# EasyEDA Pro project 完整工程.epro

# Schematic Schematic1
Create Date: 2024-04-10; Page Name: P1; Project Name: renases; Schematic Name: Schematic1; Update Date: 2024-05-06; Company: 嘉立创EDA; Page Size: A4; Version: V1.0
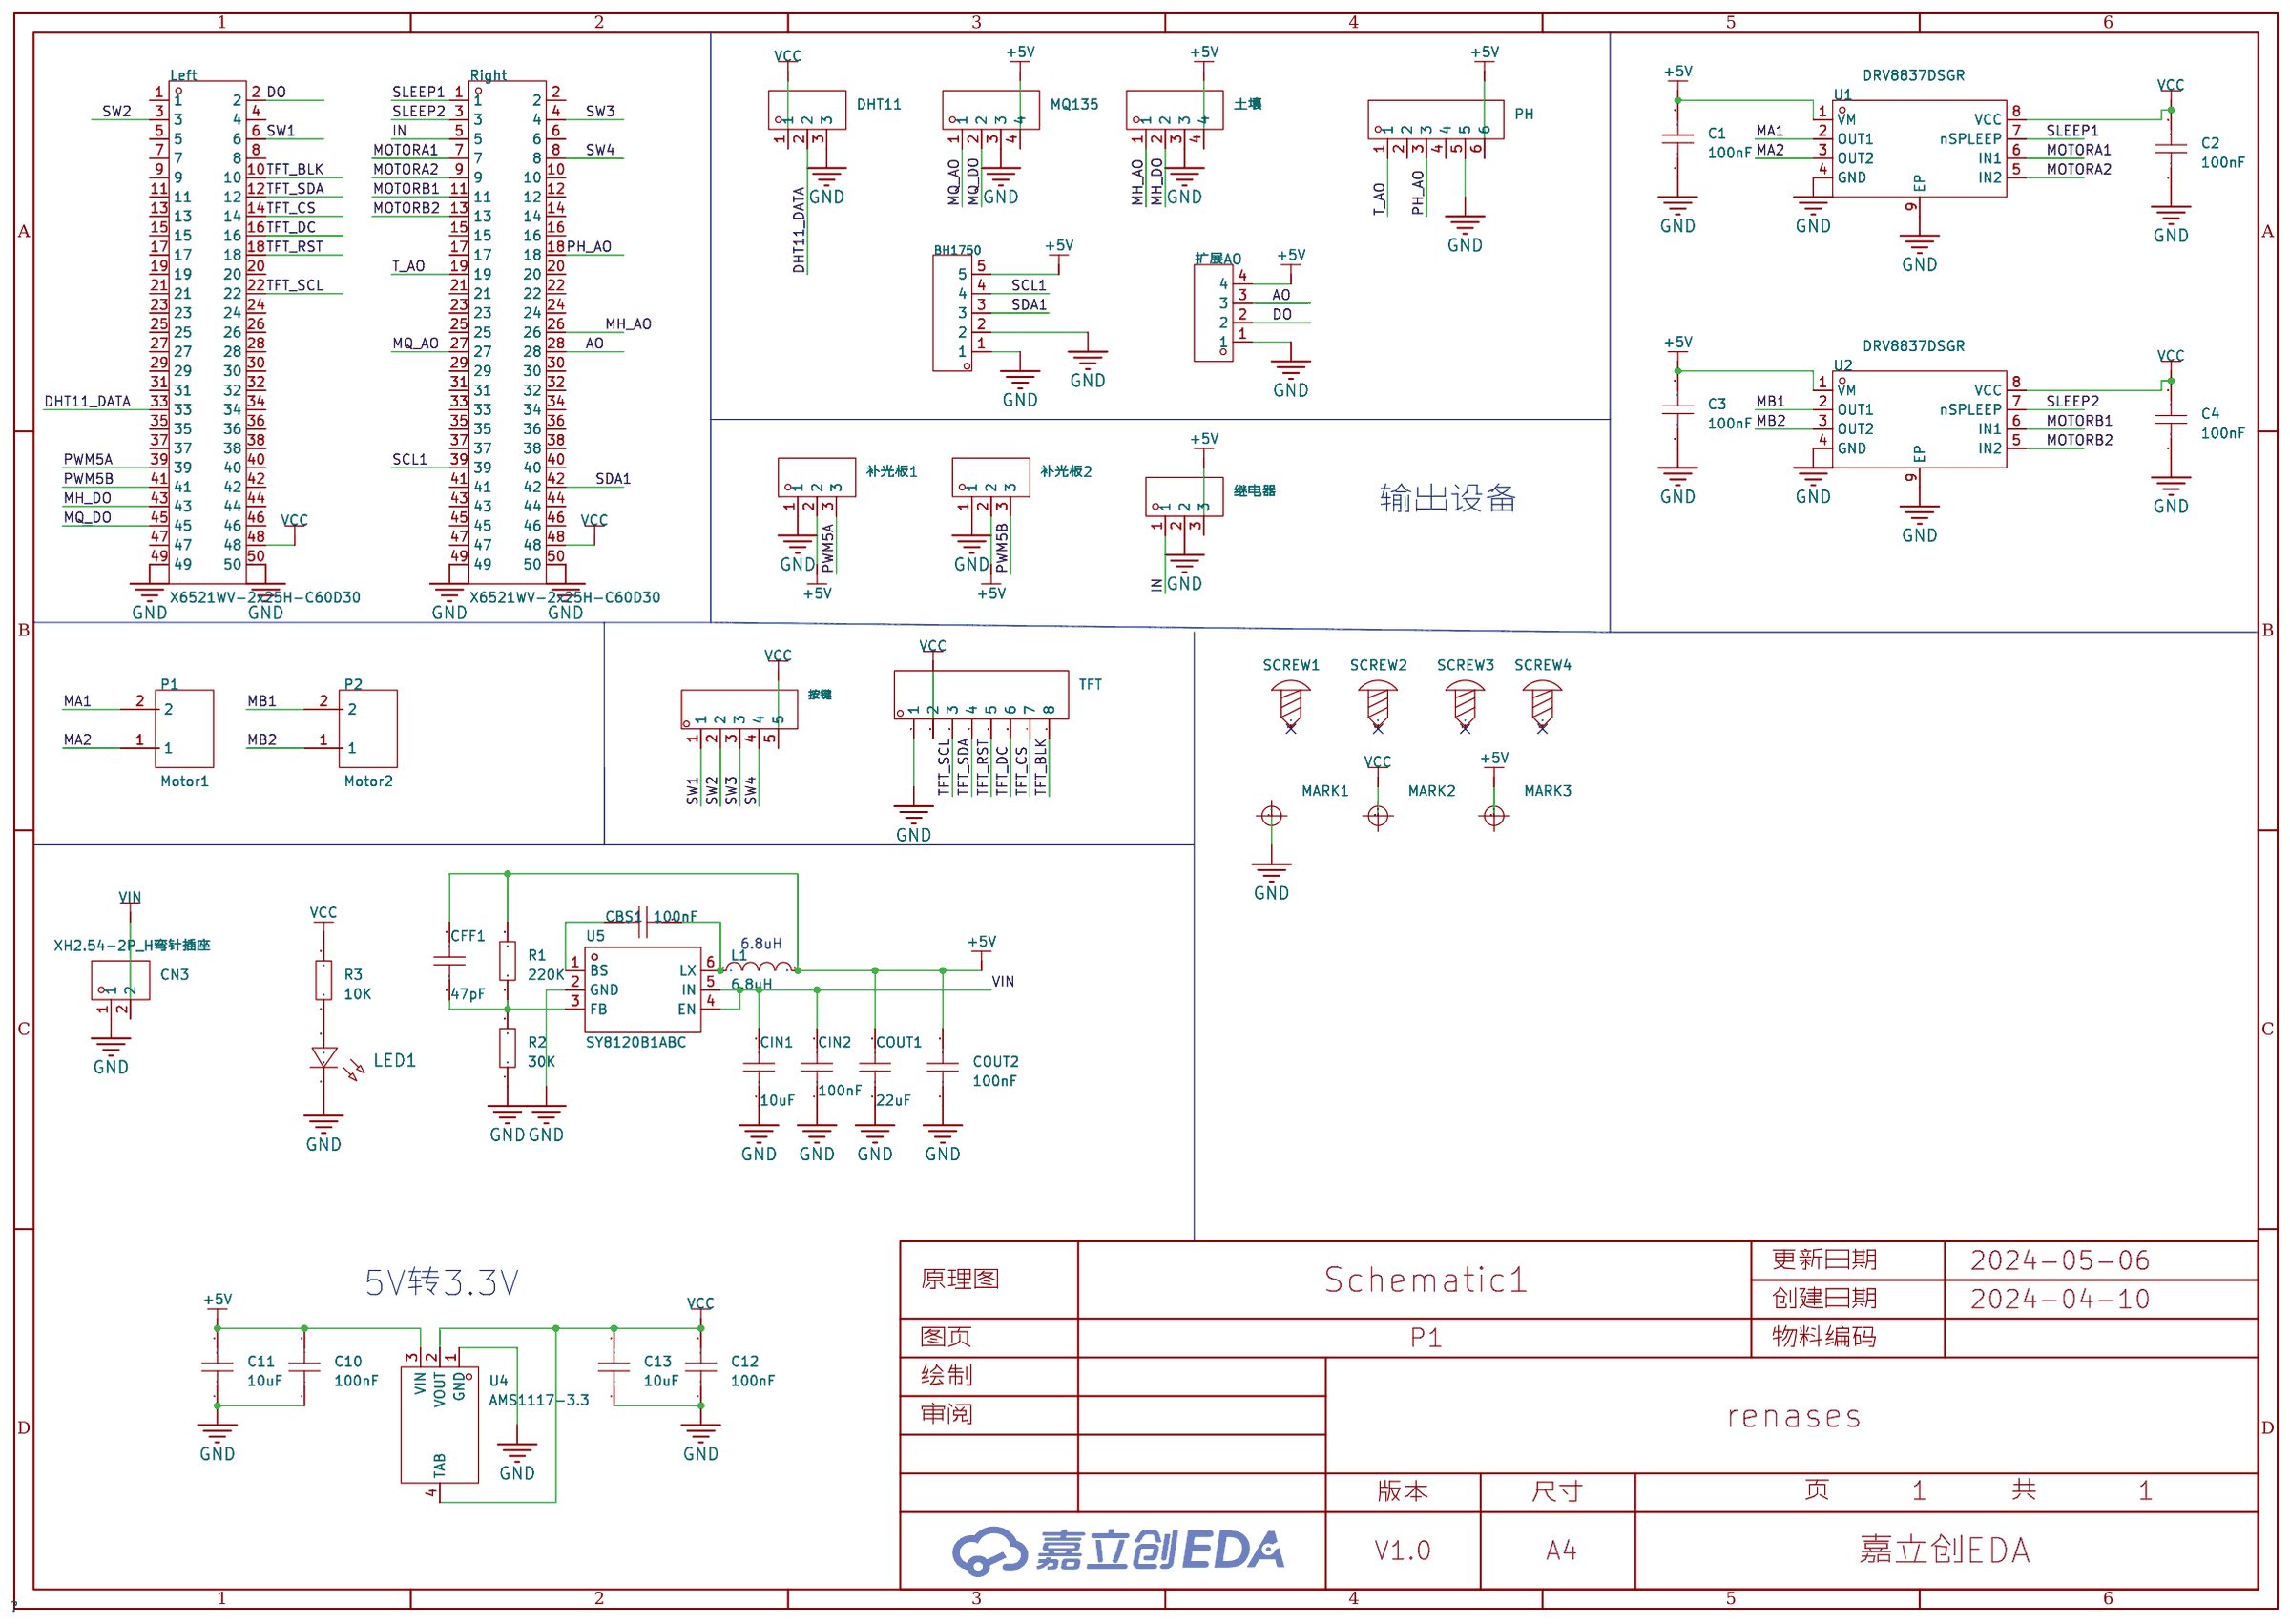
[diagram p0: schematic sheet]

## Parts
BH1750  -  [HDR-TH_5P-P2.54-V-M]
C1  100nF  [C0603]
C2  100nF  [C0603]
C3  100nF  [C0603]
C4  100nF  [C0603]
C10  100nF  [C0603]
C11  10uF  [C0603]
C12  100nF  [C0603]
C13  10uF  [C0603]
CBS1  100nF  [C0603]
CFF1  47pF  [C0603]
CIN1  10uF  [C0805]
CIN2  100nF  [C0603]
CN3  XH2.54-2P_H弯针插座  [CONN-TH_2P-P2.5_XH2.54-2P_H]
COUT1  22uF  [C0805]
COUT2  100nF  [C0603]
DHT11  -  [HDR-TH_3P-P2.54-V-M]
L1  6.8uH  [IND-SMD_L7.0-W6.6]
LED1  -  [LED_0603]
Left  X6521WV-2x25H-C60D30  [HDR-TH_50P-2.54-V-M-R2-C25-S2.54]
MARK1  -  [Mark-Point-1mm]  (no BOM)
MARK2  -  [Mark-Point-1mm]  (no BOM)
MARK3  -  [Mark-Point-1mm]  (no BOM)
MQ135  -  [HDR-TH_4P-P2.54-V-M]
P1  Motor1  [CONN-TH_WJ126V-5.0-2P]
P2  Motor2  [CONN-TH_WJ126V-5.0-2P]
PH  -  [HDR-TH_6P-P2.54-V-F]
R1  220K  [R0805]
R2  30K  [R0805]
R3  10K  [R0805]
Right  X6521WV-2x25H-C60D30  [HDR-TH_50P-2.54-V-M-R2-C25-S2.54]
SCREW1  -  [M3螺丝]
SCREW2  -  [M3螺丝]
SCREW3  -  [M3螺丝]
SCREW4  -  [M3螺丝]
TFT  -  [HDR-TH_8P-P2.54-V-M]
U1  DRV8837DSGR  [WSON-8_L2.0-W2.0-P0.50-TL-EP]
U2  DRV8837DSGR  [WSON-8_L2.0-W2.0-P0.50-TL-EP]
U4  AMS1117-3.3  [SOT-223-3_L6.5-W3.5-P3.05-LS7.0]
U5  SY8120B1ABC  [SOT-23-6_L2.9-W1.6-P0.95-LS2.8-BL]
土壤  -  [HDR-TH_4P-P2.54-V-M]
扩展AO  -  [HDR-TH_4P-P2.54-V-M]
按键  -  [HDR-TH_5P-P2.54-V-M]
继电器  -  [HDR-TH_3P-P2.54-V-M]
补光板1  -  [HDR-TH_3P-P2.54-V-M]
补光板2  -  [HDR-TH_3P-P2.54-V-M]

## Library data of the parts
BH1750 按键 = HDR-M_2.54_1x5P: Supplier Part: C358687; Supplier Footprint: 插件
C1-C4 C10-C13 CBS1 CFF1 CIN2 COUT2 = CAP_0603: Supplier Footprint: 0603
CIN1 COUT1 = CAP_0805: Supplier Footprint: 0805
CN3 = XH2.54-2P_H弯针插座: Supplier Part: C2915111; Supplier Footprint: TH-2P; JLCPCB Part Class: 扩展库; Supplier: LCSC
DHT11 继电器 补光板1 补光板2 = HDR-M_2.54_1x3P: Supplier Part: C2937625; Supplier Footprint: 插件
L1 = FXL0630-6R8-M: 电感值:6.8uH;精度:±20%;额定电流:5A;饱和电流(Isat):6A;类型:一体成型电感;; LCSC Part Name: 6.8uH ±20% 6A; Supplier Part: C167221; Manufacturer: cjiang(长江微电); Supplier Footprint: SMD,6.6x7mm; JLCPCB Part Class: Extended Part; Datasheet: https://atta.szlcsc.com/upload/public/pdf/source/20230516/3A080F5AF8C87BB81C3BA86E5F60E51A.pdf; Supplier: LCSC; Tolerance: ±20%; Rated Current: 5A; Saturation Current (Isat): 6A; DC Resistance (DCR): 48mΩ; Type: 一体成型电感
LED1 = LED_0603-R: Supplier Footprint: 0603
Left Right = X6521WV-2x25H-C60D30: 插针结构:2x25P;间距:2.54mm;行距:2.54mm;圆针/方针:方针;安装类型:-;排数:双排;总PIN位数:50P;额定电流:3A;额定电压:250V;配合针长度:6mm;塑高:2.5mm;端接针长度:3mm;触头材质:黄铜;触头镀层:金;工作温度范围:-40℃~+105℃;焊接温度(最大值):260℃;颜色:黑色;; LCSC Part Name: 2x25P 间距:2.54mm 方针; Supplier Part: C725897; Manufacturer: XKB Connection(中国星坤); Supplier Footprint: 插件,P=2.54mm; JLCPCB Part Class: Extended Part; Datasheet: https://atta.szlcsc.com/upload/public/pdf/source/20230515/3562B41AC32B1731F21EFD73DC35CC6C.pdf; Supplier: LCSC; Pin Structure: 2x25P; Pitch: 2.54mm; Row Spacing: 2.54mm; Circluar Pins/Square Pins: 方针; Number of Rows: 双排; Number of Pins: 50P; Current Rating (Max): 3A; Voltage Rating (Max): 250V; Length of Mating Pin: 6mm; Insulation Height: 2.5mm; Length of End Connection Pin: 3mm; Contact Material: 黄铜; Contact Plating: 金; Operating Temperature Range: -40℃~+105℃; Soldering Temperature(Max): 260℃; Color: 黑色
MARK1-MARK3 = Mark-Point: Mark点
MQ135 土壤 扩展AO = HDR-M_2.54_1x4P: Supplier Part: C492403; Supplier Footprint: 插件
P1 P2 = WJ126V-5.0-2P: 结构:1x2P;间距:5mm;颜色:绿色;安装方式:直插;额定电流:18A;额定电压:250V;排数:1;线规 - AWG:14~26;线规 - 平方毫米:2.5;每排PIN数:2;工作温度范围:-40℃~+105℃;; LCSC Part Name: 5mm 1x2P 排数:1 每排P数:2 直插; Supplier Part: C8404; Manufacturer: KANGNEX(康奈克斯电气); Supplier Footprint: 插件,P=5mm; JLCPCB Part Class: Extended Part; Datasheet: https://atta.szlcsc.com/upload/public/pdf/source/20191225/C8404_8F52D87DF851D149A4DEA9BD9FA83F9A.pdf; Supplier: LCSC; Structure: 1x2P; Pitch: 5mm; Color: 绿色; Mounting Style: 直插; Current Rating (Max): 18A; Voltage Rating (Max): 250V; Number of Pins: 2P; Number of Rows: 1; Wire Gauge - AWG: 14~26; Wire Gauge - mm2: 2.5; Number of PINs Per Row: 2; Operating Temperature Range: -40℃~+105℃
PH = HDR-F_2.54_1x6P: Supplier Part: C40877; Supplier Footprint: 插件
R1-R3 = Res_0805: Supplier Footprint: 0805
SCREW1-SCREW4 = M3螺丝: Supplier Footprint: 插件
TFT = HDR-M_2.54_1x8P: Supplier Part: C124381; Supplier Footprint: 插件
U1 U2 = DRV8837DSGR: 驱动电机类型:有刷直流电机;电源电压:1.8V~7V;输出电流:1.8A;接口:PWM;; LCSC Part Name: 1.8A 有刷直流电机驱动芯片 7V; Supplier Part: C39159; Manufacturer: TI(德州仪器); Supplier Footprint: WSON-8-EP(2x2); JLCPCB Part Class: 扩展库; Datasheet: https://www.ti.com/cn/lit/gpn/drv8837; Supplier: LCSC; Drive motor type: 有刷直流电机; Supply Voltage: 1.8V~7V; Output Current: 1.8A; Interface: PWM; Operating Temperature: -40℃~+85℃@(Ta)
U4 = AMS1117-3.3_C5250992: 输出类型：固定 输出极性：正 最大输入电压：18V 输出电压：3.3V 输出电流：1A 电源纹波抑制比(PSRR)：60dB@(120Hz)。当前应用较多领域：三端稳压器，机顶盒; Supplier Part: C5250992; Manufacturer: TWGMC(台湾迪嘉); Supplier Footprint: SOT-223-3L; JLCPCB Part Class: 扩展库; Datasheet: https://atta.szlcsc.com/upload/public/pdf/source/20221109/A58A92B07670E85D28928AE371260E8D.pdf; Supplier: LCSC
U5 = SY8120B1ABC: 功能类型:降压型;输入电压:-;输出电流(最大值):-;; Supplier Part: C88474; Manufacturer: silergy(矽力杰); Supplier Footprint: SOT-23-6; JLCPCB Part Class: Extended Part; Datasheet: https://atta.szlcsc.com/upload/public/pdf/source/20170329/1490752188611.pdf; Supplier: LCSC; Function: 降压型; Switch tube (built-in/external): 内置

## Nets
+5V: BH1750.5 C1.2 C3.2 C10.2 C11.2 CFF1.2 COUT1.2 COUT2.2 L1.2 MARK3.1 MQ135.4 PH.6 R1.2 U1.1(VM) U2.1(VM) U4.3(VIN) 土壤.4 扩展AO.4 继电器.3 补光板1.2 补光板2.2
GND: BH1750.1 BH1750.2 C1.1 C2.1 C3.1 C4.1 C10.1 C11.1 C12.1 C13.1 CIN1.1 CIN2.1 CN3.1 COUT1.1 COUT2.1 DHT11.3 LED1.1(C) Left.49 Left.50 MARK1.1 MQ135.3 PH.5 R2.1 Right.49 Right.50 TFT.1 U1.4(GND) U1.9(EP) U2.4(GND) U2.9(EP) U4.1(GND) U5.2(GND) 土壤.3 扩展AO.1 继电器.2 补光板1.1 补光板2.1
VCC: C2.2 C4.2 C12.2 C13.2 DHT11.1 Left.48 MARK2.1 R3.2 Right.48 TFT.2 U1.8(VCC) U2.8(VCC) U4.2(VOUT) U4.4(TAB) 按键.5
VIN: CIN1.2 CIN2.2 CN3.2 U5.4(EN) U5.5(IN)
AO: Right.28 扩展AO.3
DHT11_DATA: DHT11.2 Left.33
DO: Left.2 扩展AO.2
IN: Right.5 继电器.1
MA1: P1.2 U1.2(OUT1)
MA2: P1.1 U1.3(OUT2)
MB1: P2.2 U2.2(OUT1)
MB2: P2.1 U2.3(OUT2)
MH_AO: Right.26 土壤.1
MH_DO: Left.43 土壤.2
MOTORA1: Right.7 U1.6(IN1)
MOTORA2: Right.9 U1.5(IN2)
MOTORB1: Right.11 U2.6(IN1)
MOTORB2: Right.13 U2.5(IN2)
MQ_AO: MQ135.1 Right.27
MQ_DO: Left.45 MQ135.2
PH_AO: PH.3 Right.18
PWM5A: Left.39 补光板1.3
PWM5B: Left.41 补光板2.3
SCL1: BH1750.4 Right.39
SDA1: BH1750.3 Right.42
SLEEP1: Right.1 U1.7(nSPLEEP)
SLEEP2: Right.3 U2.7(nSPLEEP)
SW1: Left.6 按键.1
SW2: Left.3 按键.2
SW3: Right.4 按键.3
SW4: Right.8 按键.4
T_AO: PH.1 Right.19
TFT_BLK: Left.10 TFT.8
TFT_CS: Left.14 TFT.7
TFT_DC: Left.16 TFT.6
TFT_RST: Left.18 TFT.5
TFT_SCL: Left.22 TFT.3
TFT_SDA: Left.12 TFT.4
$1N11791: CBS1.1 U5.1(BS)
$1N11794: CFF1.1 R1.1 R2.2 U5.3(FB)
$1N11801: CBS1.2 L1.1 U5.6(LX)
$1N12058: LED1.2(A) R3.1

Not connected (* = marked no-connect by the designer): Left 1 4 5 7 8 9 11 13 15 17 19 20 21 23 24 25 26 27 28 29 30 31 32 34 35 36 37 38 40 42 44 46 47; PH 2 4; Right 2 6 10 12 14 15 16 17 20 21 22 23 24 25 29 30 31 32 33 34 35 36 37 38 40 41 43 44 45 46 47; SCREW1 1*; SCREW2 1*; SCREW3 1*; SCREW4 1*

## Notes on the sheet
- 输出设备
- 6.8uH
- 5V转3.3V

# Board PCB1
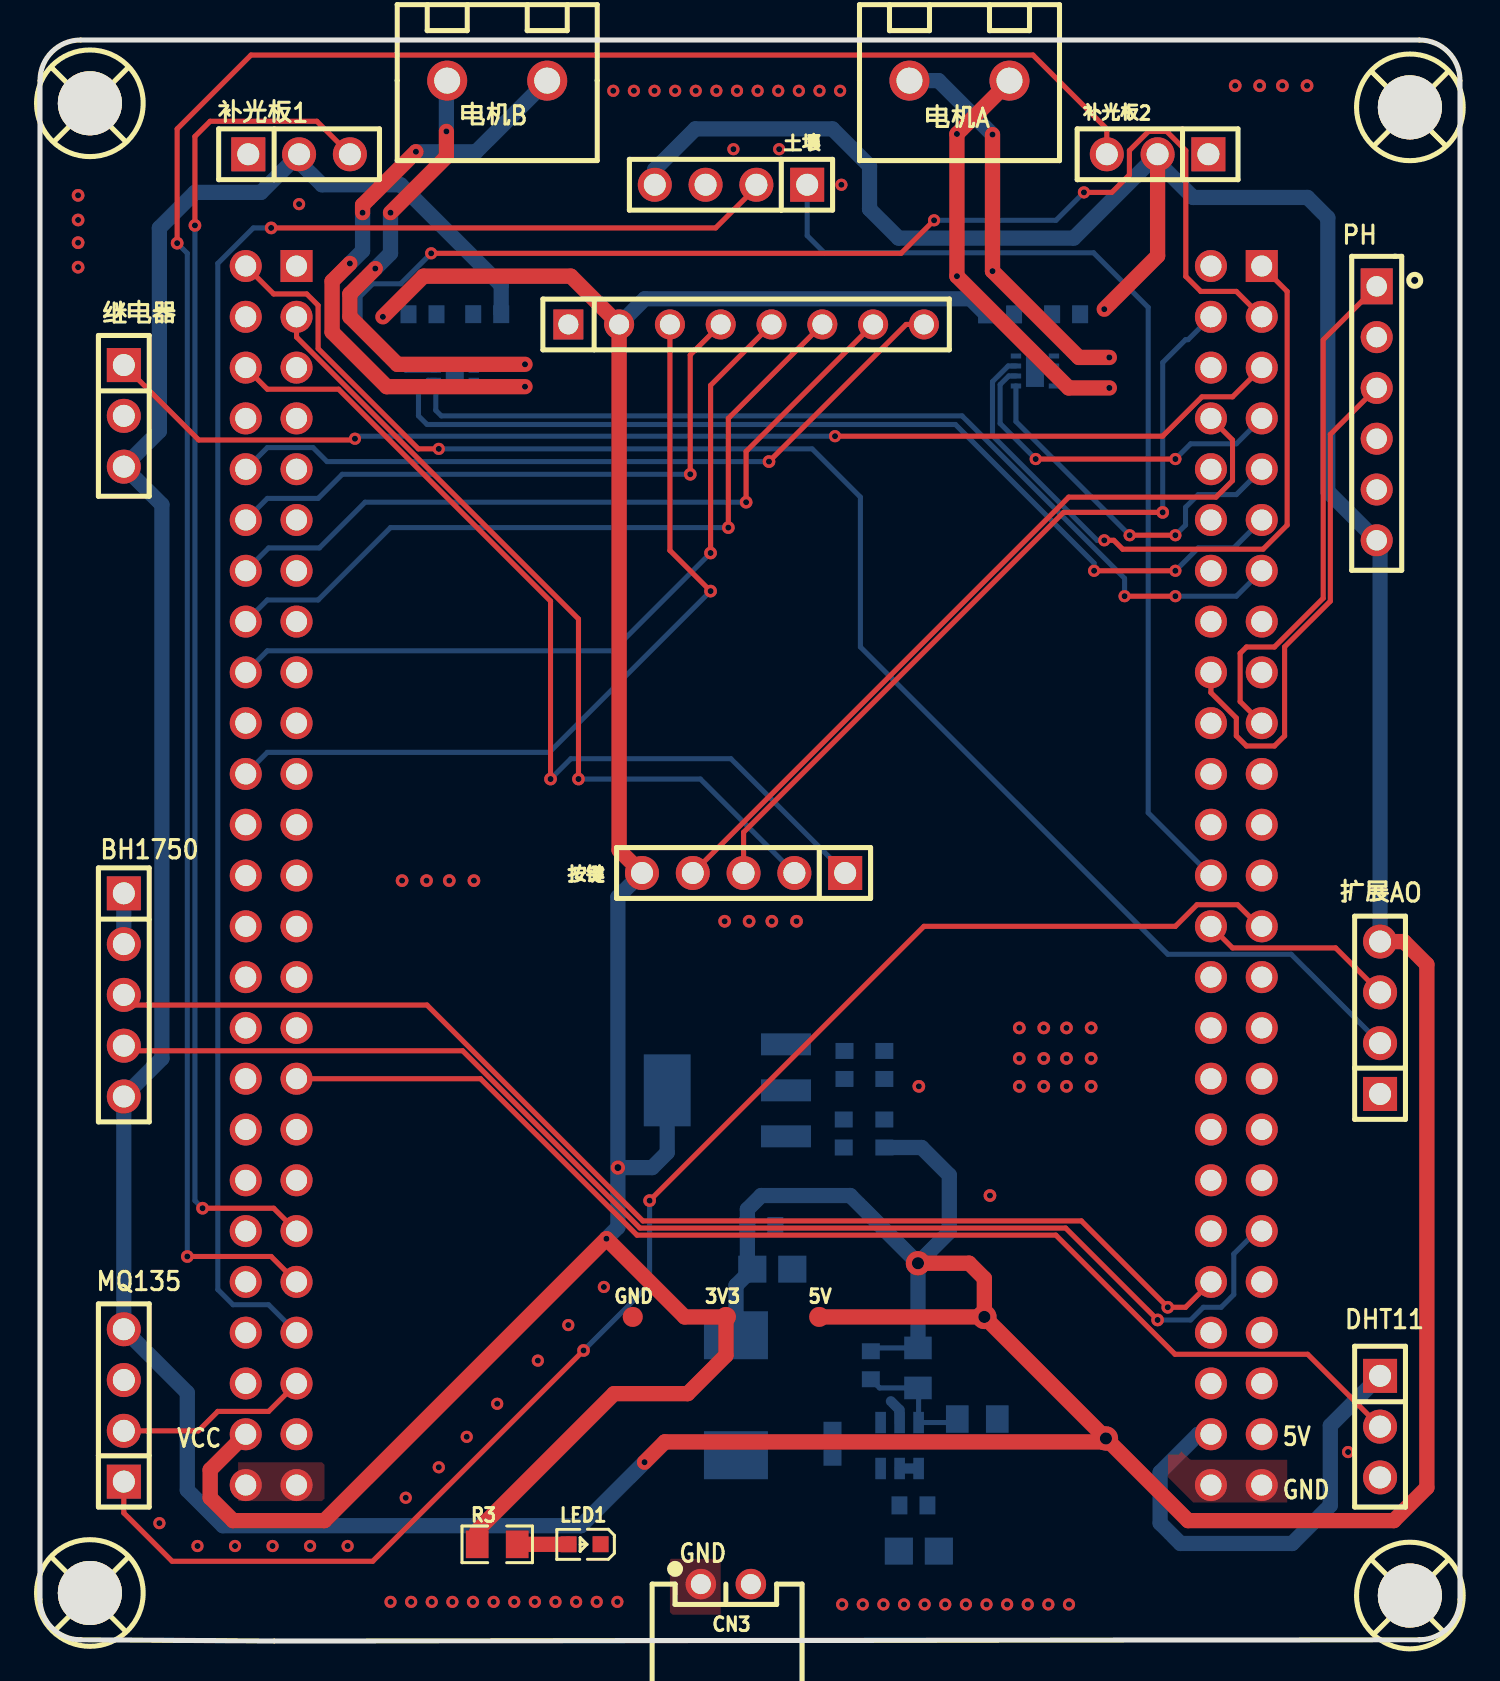
[diagram p1: board, top side]
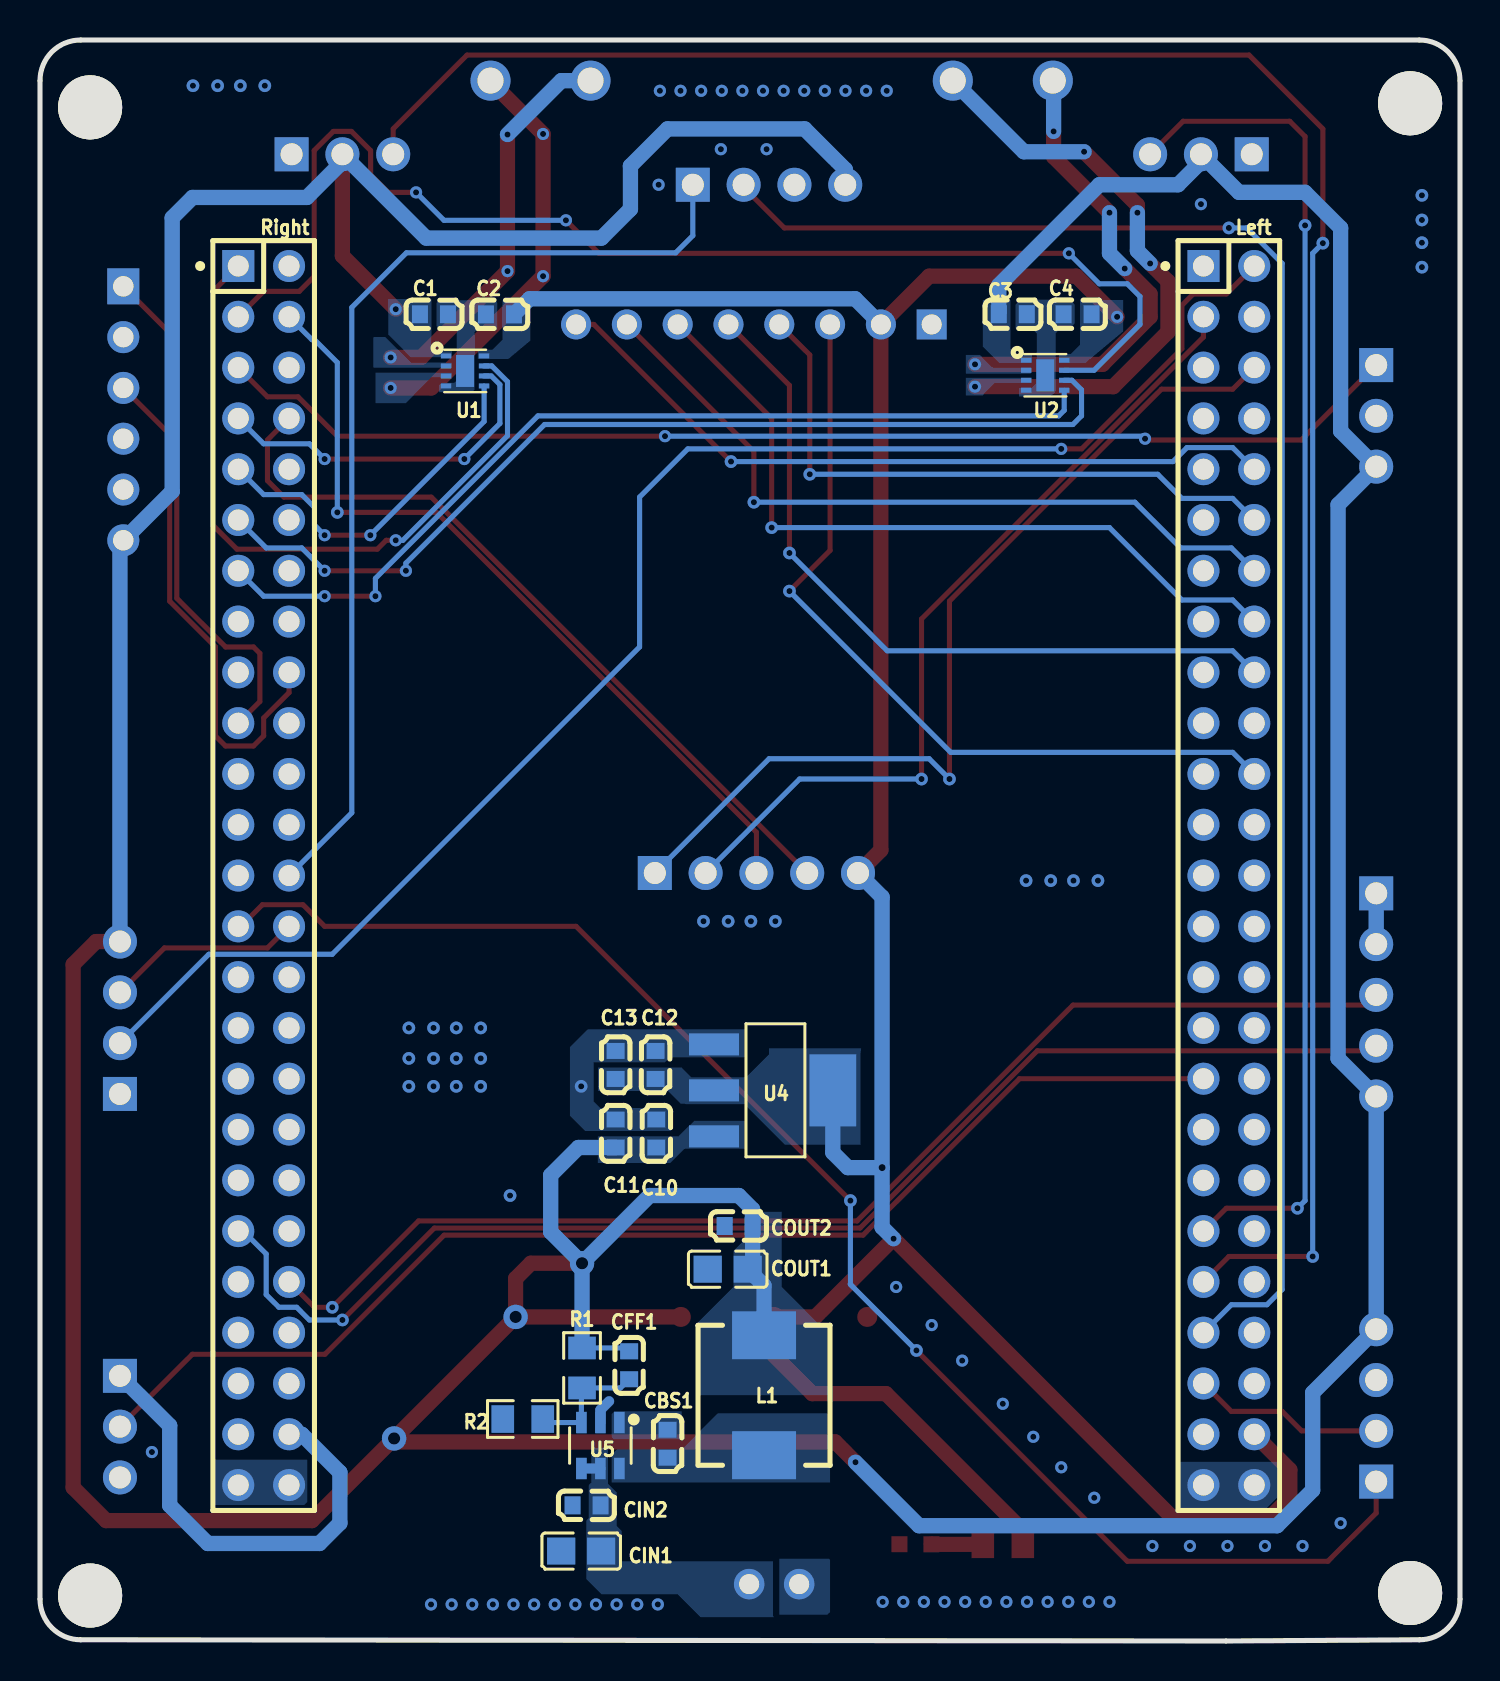
[diagram p2: board, bottom side, seen from below]

Outline 71 x 80.06 mm; copper layers: Top Layer, Bottom Layer. Coordinates in mm from the lower left corner of the outline.
Outline path: 0,78.03 0,2.09 arc(0.6,0.66) 2.03,0.06 11.71,0 68.97,0.06 arc(70.4,0.66) 71,2.09 71,78.03 arc(70.4,79.47) 68.97,80.06 2.03,80.06 arc(0.6,79.47) 0,78.03
Stack: Top Layer 0.035mm / Dielectric1 1.51mm FR4 er 4.5 / Bottom Layer 0.035mm

## Design rules (mm)
template: JLCPCB Capability(Two Layers Board)
spacing copperThickness1oz (default): track to track 0.102, other pairs 0.152 to 0.3
spacing copperThickness2oz: track to track 0.203, other pairs 0.152 to 0.3
track width copperThickness1oz (default): min 0.127, default 0.254, max 2.54
track width copperThickness2oz: min 0.203, default 0.254, max 2.54
differential pair differentialPair (default): width min 0.127, default 0.254, max 2.54; gap min 0.152, default 0.152
via viaSize (default): diameter min 0.5, default 0.61, max 10; hole min 0.3, default 0.305, max 6.3

## Placement (name value [footprint] x y rotation side)
3V3  -  [Mark-Point-1mm]  34.3 16.21 0 top
5V  -  [Mark-Point-1mm]  38.96 16.21 0 top
BH1750  -  [HDR-TH_5P-P2.54-V-M]  4.19 32.31 270 top
C1  100nF  [C0603]  51.31 66.35 0 bottom
C2  100nF  [C0603]  48 66.34 180 bottom
C3  100nF  [C0603]  22.36 66.35 0 bottom
C4  100nF  [C0603]  19.12 66.35 180 bottom
C10  100nF  [C0603]  40.19 25.38 270 bottom
C11  10uF  [C0603]  42.22 25.38 270 bottom
C12  100nF  [C0603]  40.22 28.81 270 bottom
C13  10uF  [C0603]  42.22 28.81 270 bottom
CBS1  100nF  [C0603]  39.62 9.87 270 bottom
CFF1  47pF  [C0603]  41.54 13.79 90 bottom
CIN1  10uF  [C0805]  43.94 4.5 180 bottom
CIN2  100nF  [C0603]  43.67 6.78 180 bottom
CN3  XH2.54-2P_H弯针插座  [CONN-TH_2P-P2.5_XH2.54-2P_H]  34.29 2.85 0 top
COUT1  22uF  [C0805]  36.61 18.59 180 bottom
COUT2  100nF  [C0603]  36.07 20.75 180 bottom
DHT11  -  [HDR-TH_3P-P2.54-V-M]  67 10.72 270 top
GND  -  [Mark-Point-1mm]  29.64 16.21 0 top
L1  6.8uH  [IND-SMD_L7.0-W6.6]  34.8 12.29 90 bottom
LED1  -  [LED_0603]  27.18 4.83 180 top
Left  X6521WV-2x25H-C60D30  [HDR-TH_50P-2.54-V-M-R2-C25-S2.54]  11.56 38.28 270 bottom
MQ135  -  [HDR-TH_4P-P2.54-V-M]  4.19 11.78 90 top
PH  -  [HDR-TH_6P-P2.54-V-F]  66.83 61.39 270 top
R1  220K  [R0805]  43.9 13.65 90 bottom
R2  30K  [R0805]  46.86 11.1 180 bottom
R3  10K  [R0805]  22.86 4.83 180 top
Right  X6521WV-2x25H-C60D30  [HDR-TH_50P-2.54-V-M-R2-C25-S2.54]  59.82 38.28 270 bottom
SCREW1  -  [M3螺丝]  2.56 76.83 0 top
SCREW2  -  [M3螺丝]  68.56 76.63 0 top
SCREW3  -  [M3螺丝]  2.56 2.34 0 top
SCREW4  -  [M3螺丝]  68.56 2.21 0 top
TFT  -  [HDR-TH_8P-P2.54-V-M]  35.31 65.84 0 top
U1  DRV8837DSGR  [WSON-8_L2.0-W2.0-P0.50-TL-EP]  49.75 63.51 180 bottom
U2  DRV8837DSGR  [WSON-8_L2.0-W2.0-P0.50-TL-EP]  20.74 63.29 180 bottom
U4  AMS1117-3.3  [SOT-223-3_L6.5-W3.5-P3.05-LS7.0]  34.33 27.54 0 bottom
U5  SY8120B1ABC  [SOT-23-6_L2.9-W1.6-P0.95-LS2.8-BL]  42.98 9.78 0 bottom
土壤  -  [HDR-TH_4P-P2.54-V-M]  34.55 72.82 180 top
扩展AO  -  [HDR-TH_4P-P2.54-V-M]  67 31.17 90 top
按键  -  [HDR-TH_5P-P2.54-V-M]  35.18 38.41 180 top
电机A  Motor1  [CONN-TH_WJ126V-5.0-2P]  45.97 78.03 270 top
电机B  Motor2  [CONN-TH_WJ126V-5.0-2P]  22.86 78.03 270 top
继电器  -  [HDR-TH_3P-P2.54-V-M]  4.19 61.27 270 top
补光板1  -  [HDR-TH_3P-P2.54-V-M]  12.95 74.35 0 top
补光板2  -  [HDR-TH_3P-P2.54-V-M]  55.88 74.35 180 top

## Footprints (pads in the part's own frame, mm; a bottom-side part is the same pattern mirrored in y, then rotated)
C0603
  rect 0.8x0.9 smd: 1(-0.7,0) 2(0.7,0)
C0805
  rect 1.41x1.35 smd: 1(-1,0) 2(1,0)
CONN-TH_2P-P2.5_XH2.54-2P_H
  round 1.524 hole 1: 1(-1.25,0) 2(1.25,0)
CONN-TH_WJ126V-5.0-2P
  round 2 hole 1.3: 1(0,2.501) 2(0,-2.501)
HDR-TH_3P-P2.54-V-M
  rect 1.7x1.7 hole 1.1: 1(-2.54,0)
  round 1.7 hole 1.1: 2(0,0) 3(2.54,0)
HDR-TH_4P-P2.54-V-M
  rect 1.7x1.7 hole 1.1: 1(-3.81,0)
  round 1.7 hole 1.1: 2(-1.27,0) 3(1.27,0) 4(3.81,0)
HDR-TH_5P-P2.54-V-M
  rect 1.7x1.7 hole 1.1: 1(-5.08,0)
  round 1.7 hole 1.1: 2(-2.54,0) 3(0,0) 4(2.54,0) 5(5.08,0)
HDR-TH_6P-P2.54-V-F
  rect 1.8x1.6 hole 1.02: 1(-6.35,0)
  round 1.6 hole 1.02: 2(-3.81,0) 3(-1.27,0) 4(1.27,0) 5(3.81,0) 6(6.35,0)
HDR-TH_8P-P2.54-V-M
  rect 1.5x1.5 hole 1: 1(-8.89,0)
  round 1.5 hole 1: 2(-6.35,0) 3(-3.81,0) 4(-1.27,0) 5(1.27,0) 6(3.81,0) 7(6.35,0) 8(8.89,0)
HDR-TH_50P-2.54-V-M-R2-C25-S2.54
  rect 1.6x1.6 hole 1.05: 1(-30.48,-1.27)
  round 1.6 hole 1.05: 2(-30.48,1.27) 3(-27.94,-1.27) 4(-27.94,1.27) 5(-25.4,-1.27) 6(-25.4,1.27) 7(-22.86,-1.27) 8(-22.86,1.27) 9(-20.32,-1.27) 10(-20.32,1.27) 11(-17.78,-1.27) 12(-17.78,1.27) 13(-15.24,-1.27) 14(-15.24,1.27) 15(-12.7,-1.27) 16(-12.7,1.27) 17(-10.16,-1.27) 18(-10.16,1.27) 19(-7.62,-1.27) 20(-7.62,1.27) 21(-5.08,-1.27) 22(-5.08,1.27) 23(-2.54,-1.27) 24(-2.54,1.27) 25(0,-1.27) 26(0,1.27) 27(2.54,-1.27) 28(2.54,1.27) 29(5.08,-1.27) 30(5.08,1.27) 31(7.62,-1.27) 32(7.62,1.27) 33(10.16,-1.27) 34(10.16,1.27) 35(12.7,-1.27) 36(12.7,1.27) 37(15.24,-1.27) 38(15.24,1.27) 39(17.78,-1.27) 40(17.78,1.27) 41(20.32,-1.27) 42(20.32,1.27) 43(22.86,-1.27) 44(22.86,1.27) 45(25.4,-1.27) 46(25.4,1.27) 47(27.94,-1.27) 48(27.94,1.27) 49(30.48,-1.27) 50(30.48,1.27)
IND-SMD_L7.0-W6.6
  rect 2.4x3.2 smd: 1(-3,0) 2(3,0)
LED_0603
  rect 0.8x0.8 smd: 1(-0.851,-0.01) 2(0.75,-0.005)
M3螺丝
  round 3.2 hole 3.2: 1(-0.064,0.064)
Mark-Point-1mm
  round 1 smd: 1(0,0)
R0805
  rect 1.133x1.377 smd: 1(-1,0) 2(1,0)
SOT-23-6_L2.9-W1.6-P0.95-LS2.8-BL
  rect 0.532x1.072 smd: 1(-0.95,-1.149) 2(0,-1.149) 3(0.95,-1.149) 4(0.95,1.149) 5(0,1.149) 6(-0.95,1.149)
SOT-223-3_L6.5-W3.5-P3.05-LS7.0
  rect 2.5x1.1 smd: 1(2.97,-2.3) 2(2.97,0) 3(2.97,2.3)
  rect 2.34x3.6 smd: 4(-2.97,0)
WSON-8_L2.0-W2.0-P0.50-TL-EP
  rect 0.521x0.25 smd: 1(-0.95,0.75) 2(-0.95,0.25) 3(-0.95,-0.25) 4(-0.95,-0.75) 5(0.95,-0.75) 6(0.95,-0.25) 7(0.95,0.25) 8(0.95,0.75)
  rect 0.9x1.6 smd: 9(0,0)

## Nets
As in the schematic, except:
+5V: 5V.1 BH1750.5 C1.2 C3.2 C10.2 C11.2 CFF1.2 COUT1.2 COUT2.2 L1.2 MQ135.4 PH.6 R1.2 U1.1 U2.1 U4.3 土壤.4 扩展AO.4 继电器.3 补光板1.2 补光板2.2
GND: BH1750.1 BH1750.2 C1.1 C2.1 C3.1 C4.1 C10.1 C11.1 C12.1 C13.1 CIN1.1 CIN2.1 CN3.1 COUT1.1 COUT2.1 DHT11.3 GND.1 LED1.1 Left.49 Left.50 MQ135.3 PH.5 R2.1 Right.49 Right.50 TFT.1 U1.4 U1.9 U2.4 U2.9 U4.1 U5.2 土壤.3 扩展AO.1 继电器.2 补光板1.1 补光板2.1
VCC: 3V3.1 C2.2 C4.2 C12.2 C13.2 DHT11.1 Left.48 R3.2 Right.48 TFT.2 U1.8 U2.8 U4.2 U4.4 按键.5
MA1: U1.2 电机A.2
MA2: U1.3 电机A.1
MB1: U2.2 电机B.2
MB2: U2.3 电机B.1

Pads without a net: Left 1 4 5 7 8 9 11 13 15 17 19 20 21 23 24 25 26 27 28 29 30 31 32 34 35 36 37 38 40 42 44 46 47; PH 2 4; Right 2 6 10 12 14 15 16 17 20 21 22 23 24 25 29 30 31 32 33 34 35 36 37 38 40 41 43 44 45 46 47; SCREW1 1; SCREW2 1; SCREW3 1; SCREW4 1

## Via types
v1: diameter 0.635, hole 0.305, Top Layer to Bottom Layer, 48 vias
v2: diameter 0.61, hole 0.305, Top Layer to Bottom Layer, 87 vias
v3: diameter 1.219, hole 0.61, Top Layer to Bottom Layer, 3 vias
v4: diameter 0.711, hole 0.355, Top Layer to Bottom Layer, 1 via

## Routing (per net, layer and track width the routed paths; a pad name or vN(x,y) marks a point on that pad's centre or on a via; arc(x,y) is an arc through that point)
+5V: length 328.6
  Top Layer w0.762: v2(53.21,66.6) 55.88,69.27 补光板2.2 ; v3(53.3,10.13) 57.4,6.02 67.69,6.02 69.34,7.67 69.34,33.83 68.2,34.98 扩展AO.4 ; v3(53.3,10.13) v3(47.22,16.21) ; v3(53.3,10.13) 53.12,9.96 31.24,9.96 v2(30.23,8.94) ; v3(47.22,16.21) 5V.1 ; v3(47.22,16.21) 47.22,18.13 46.46,18.89 v3(43.9,18.89)
  Bottom Layer w0.254: R1.2 41.71,14.65 41.54,14.49
  Bottom Layer w0.762: 12.95,73.97 补光板1.2 ; 12.95,73.97 12.57,73.97 11.05,72.44 7.75,72.44 5.97,70.66 5.97,60.5 4.19,58.73 6.1,56.82 6.1,29.13 BH1750.5 MQ135.4 7.37,12.41 7.37,7.54 9.14,5.77 27.05,5.77 v2(30.23,8.94) ; 12.95,73.97 14.1,72.82 18.03,72.82 23.06,67.8 C3.2 ; v3(43.9,18.89) 45.47,20.46 45.47,23.29 44.08,24.68 C11.2 ; v3(43.9,18.89) R1.2 ; v3(43.9,18.89) 40.51,22.28 36.06,22.28 35.37,21.58 COUT2.2 35.37,18.84 COUT1.2 34.8,17.78 L1.2 ; 扩展AO.4 67,54.87 PH.6 64.39,57.49 64.39,71.17 63.37,72.19 57.66,72.19 55.88,73.97 补光板2.2 51.69,70.16 42.93,70.16 41.48,71.6 41.48,73.76 39.62,75.62 32.77,75.62 30.74,73.59 土壤.4
GND: length 3.8
  Bottom Layer w0.508: U5.2 42.98,11.56 42.55,11.99
  Bottom Layer w0.762: BH1750.2 BH1750.1
  vias: v1(1.91,72.29) v1(1.91,71.06) v1(1.91,69.92) v1(1.91,68.7) v1(18.1,38.02) v1(19.33,38.02) v1(20.46,38.02) v1(21.7,38.02) v1(34.23,35.99) v1(35.46,35.99) v1(36.59,35.99) v1(37.83,35.99) v1(43.94,27.74) v1(47.5,22.28) v1(48.96,30.66) v1(48.96,29.13) v1(48.96,27.74) v1(50.19,30.66) v1(50.19,29.13) v1(50.19,27.74) v1(51.32,30.66) v1(51.32,29.13) v1(51.32,27.74) v1(52.56,30.66) v1(52.56,29.13) v1(52.56,27.74) v1(59.76,77.78) v1(60.98,77.78) v1(62.12,77.78) v1(63.35,77.78) v2(5.97,5.89) v2(7.87,4.75) v2(9.75,4.75) v2(11.63,4.75) v2(12.95,71.85) v2(13.5,4.75) v2(15.38,4.75) v2(17.53,1.96) v2(18.29,7.16) v2(18.56,1.96) v2(19.59,1.96) v2(19.94,8.69) v2(20.62,1.96) v2(21.34,10.21) v2(21.65,1.96) v2(22.68,1.96) v2(22.86,11.86) v2(23.71,1.96) v2(24.74,1.96) v2(24.89,14.02) v2(25.77,1.96) v2(26.42,15.8) v2(26.81,1.96) v2(27.84,1.96) v2(28.19,17.7) v2(28.66,77.52) v2(28.87,1.96) v2(29.69,77.52) v2(30.73,77.52) v2(31.76,77.52) v2(32.79,77.52) v2(33.82,77.52) v2(34.67,74.6) v2(34.85,77.52) v2(35.88,77.52) v2(36.91,77.52) v2(36.96,74.6) v2(37.94,77.52) v2(38.97,77.52) v2(40.01,77.52) v2(40.07,72.82) v2(40.11,1.83) v2(41.14,1.83) v2(42.17,1.83) v2(43.2,1.83) v2(44.23,1.83) v2(45.26,1.83) v2(46.29,1.83) v2(47.33,1.83) v2(48.36,1.83) v2(49.39,1.83) v2(50.42,1.83) v2(51.45,1.83) v2(65.41,9.45)
VCC: length 165.1
  Top Layer w0.762: v2(17.14,66.22) 19.18,68.25 26.54,68.25 TFT.2 28.96,39.55 按键.5 ; Left.48 8.51,8.56 8.51,7.16 9.65,6.02 14.22,6.02 v2(28.32,20.12) 32.23,16.21 3V3.1 34.3,14.28 32.39,12.37 28.7,12.37 21.86,5.53 R3.2
  Bottom Layer w0.762: TFT.2 30.24,67.12 46.52,67.12 C2.2 ; v2(28.32,20.12) 28.9,20.69 v4(28.9,23.67) ; U4.4 31.36,24.43 30.61,23.67 v4(28.9,23.67) ; v4(28.9,23.67) 28.9,37.2 按键.5 ; DHT11.1 64.52,10.77 64.52,6.78 62.61,4.88 57.02,4.88 56.01,5.89 56.01,8.43 57.91,10.34 Right.48
VIN: length 0.9
  Bottom Layer w0.508: U5.5 U5.4
AO: length 9.8
  Top Layer w0.254: Right.28 59.63,34.66 64.78,34.66 扩展AO.3
DHT11_DATA: length 61.4
  Top Layer w0.254: Left.33 22.03,28.12 29.85,20.3 50.79,20.3 56.75,14.34 63.38,14.34 DHT11.2
DO: length 78.5
  Top Layer w0.254: Left.2 11.68,67.36 13.34,67.36 13.91,66.79 13.91,64.63 18.92,59.61 v2(19.94,59.61)
  Bottom Layer w0.254: v2(19.94,59.61) 38.61,59.61 41.02,57.2 41.02,49.71 56.39,34.34 62.56,34.34 扩展AO.2
IN: length 59.9
  Top Layer w0.254: v2(15.75,60.12) 15.68,60.06 7.94,60.06 继电器.1 ; Right.5 59.63,62.22 58.1,62.22 56.13,60.25 v2(39.75,60.25)
  Bottom Layer w0.254: v2(15.75,60.12) 15.88,60.25 v2(39.75,60.25)
MA1: length 19.7
  Top Layer w0.762: v2(47.63,75.33) v2(47.63,68.5) 51.94,64.19 v2(53.47,64.19)
  Bottom Layer w0.762: v2(47.63,75.33) 44.93,78.03 电机A.2
MA2: length 20.8
  Top Layer w0.762: 电机A.1 48.47,77.99 v2(45.85,75.36) v2(45.85,68.25) 51.43,62.66 v2(53.47,62.66)
MB1: length 23.6
  Top Layer w0.762: v2(17.53,71.43) 20.32,74.22 v2(20.32,75.49) ; v2(24.25,63.84) 17.87,63.84 15.49,66.22 15.49,67.36 v2(16.76,68.63)
  Bottom Layer w0.762: 电机B.2 20.32,77.99 v2(20.32,75.49) ; v2(16.76,68.63) 17.53,69.39 v2(17.53,71.43)
MB2: length 29.6
  Top Layer w0.762: v2(16.13,71.43) 16.13,71.81 v2(18.8,74.47) ; v2(24.25,62.73) 17.34,62.73 14.61,65.46 14.61,68 v2(15.49,68.89)
  Bottom Layer w0.762: 电机B.1 21.8,74.47 v2(18.8,74.47) ; v2(16.13,71.43) 16.13,69.52 v2(15.49,68.89)
MH_AO: length 50.8
  Bottom Layer w0.254: Right.26 55.41,41.42 55.41,66.69 52.68,69.42 39.22,69.42 38.36,70.28 土壤.1
MH_DO: length 84.8
  Top Layer w0.254: v1(11.56,70.66) 33.78,70.66 35.82,72.7 土壤.2
  Bottom Layer w0.254: v1(11.56,70.66) 10.67,70.66 8.89,68.89 8.89,17.58 9.65,16.82 11.43,16.82 Left.43
MOTORA1: length 17.5
  Top Layer w0.254: v2(49.78,59.11) 56.74,59.11
  Bottom Layer w0.254: Right.7 59.82,59.87 57.53,59.87 v2(56.77,59.11) ; v2(49.78,59.11) 48.01,60.88 48.01,62.83 48.44,63.26 U1.6
MOTORA2: length 18.3
  Top Layer w0.254: v2(56.77,55.3) v2(54.48,55.3)
  Bottom Layer w0.254: Right.9 59.82,57.33 57.91,57.33 57.28,56.69 57.28,55.8 v2(56.77,55.3) ; v2(54.48,55.3) 48.8,60.98 U1.5
MOTORB1: length 48.8
  Top Layer w0.254: v2(52.7,53.52) 56.55,53.52
  Bottom Layer w0.254: U2.6 19.4,63.04 18.92,62.57 18.92,61.27 19.36,60.83 45.77,60.83 52.7,53.9 v2(52.7,53.52) ; v2(56.77,53.52) 57.91,54.66 59.69,54.66 Right.11
MOTORB2: length 47
  Top Layer w0.254: 56.53,52.25 v2(54.23,52.25)
  Bottom Layer w0.254: Right.13 59.82,52.25 v2(56.77,52.25) ; U2.5 19.79,61.54 20.07,61.27 46.1,61.27 54.23,53.14 v2(54.23,52.25)
MQ_AO: length 76
  Top Layer w0.254: MQ135.1 4.19,6.4 6.6,3.99 16.64,3.99 v1(27.18,14.53) ; Right.27 60.96,35.74 59.88,36.82 57.85,36.82 56.77,35.74 44.2,35.74 v1(30.48,22.02)
  Bottom Layer w0.254: v1(30.48,22.02) 30.48,17.83 v1(27.18,14.53)
MQ_DO: length 9.6
  Top Layer w0.254: Left.45 11.43,11.48 8.89,11.48 7.92,10.51 MQ135.2
PH_AO: length 25.8
  Top Layer w0.254: PH.3 64.52,60.34 64.52,52 62.23,49.71 62.23,45.26 61.72,44.76 60.33,44.76 59.82,45.26 59.82,46.16 58.55,47.43 Right.18
PWM5A: length 67.7
  Top Layer w0.254: 15.49,74.35 13.84,76 8.51,76 7.75,75.24 v1(7.75,70.79) ; Left.39 11.68,21.64 v1(8.13,21.64)
  Bottom Layer w0.254: v1(8.13,21.64) 7.75,22.02 v1(7.75,70.79)
PWM5B: length 113.4
  Top Layer w0.254: Left.41 11.56,19.23 v1(7.37,19.23) ; v1(6.86,69.9) 6.86,75.62 10.55,79.31 49.65,79.31 53.34,75.62 补光板2.3
  Bottom Layer w0.254: v1(7.37,19.23) 7.37,69.39 v1(6.86,69.9)
SCL1: length 65.6
  Top Layer w0.254: BH1750.4 4.45,29.52 21.13,29.52 30,20.65 51.28,20.65 v1(55.88,16.05)
  Bottom Layer w0.254: Right.39 60.83,20.5 59.69,19.36 59.69,17.32 59.05,16.69 58.17,16.69 57.53,16.05 v1(55.88,16.05)
SDA1: length 61.4
  Top Layer w0.254: Right.42 57.28,16.69 v1(56.39,16.69) 52.07,21.01 30.14,21.01 19.35,31.8 4.7,31.8 BH1750.3
SLEEP1: length 35.3
  Top Layer w0.254: Right.1 62.36,67.49 62.36,55.8 61.15,54.6 54.13,54.6 53.69,55.04 v2(53.21,55.04)
  Bottom Layer w0.254: U1.7 48.41,63.76 47.63,62.98 47.63,60.27 52.85,55.04 v2(53.21,55.04)
SLEEP2: length 62.9
  Top Layer w0.254: v2(44.7,71.04) 43.05,69.39 v2(19.56,69.39) ; v2(52.2,72.44) 53.59,72.44 54.47,73.32 54.47,74.53 55.43,75.49 56.33,75.49 57.29,74.53 57.29,68.24 58.04,67.49 59.82,67.49 Right.3
  Bottom Layer w0.254: v2(44.7,71.04) 50.8,71.04 v2(52.2,72.44) ; U2.7 18.3,63.54 16,65.84 16,67.23 16.64,67.87 18.03,67.87 v2(19.56,69.39)
SW1: length 46.5
  Top Layer w0.254: Left.6 11.37,62.6 14.93,62.6 25.53,52 v1(25.53,43.1)
  Bottom Layer w0.254: v1(25.53,43.1) 26.54,44.12 34.54,44.12 按键.1
SW2: length 41.7
  Top Layer w0.254: Left.3 12.83,65.21 26.92,51.11 v1(26.92,43.1)
  Bottom Layer w0.254: 按键.2 33.02,43.1 v1(26.92,43.1)
SW3: length 40.5
  Top Layer w0.254: v1(56.13,56.44) 51.18,56.44 35.18,40.44 按键.3
  Bottom Layer w0.254: v1(56.13,56.44) 56.13,63.93 57.28,65.08 57.4,65.08 Right.4
SW4: length 38.7
  Top Layer w0.254: Right.8 59.63,60.06 59.63,58.03 58.8,57.2 51.43,57.2 按键.4
T_AO: length 25.9
  Top Layer w0.254: PH.1 64.16,65.07 64.16,52.15 61.72,49.71 60.33,49.71 60.01,49.39 60.01,46.98 Right.19
TFT_BLK: length 37.5
  Top Layer w0.254: v1(36.45,58.98) 43.31,65.84 TFT.8
  Bottom Layer w0.254: v1(36.45,58.98) 14.35,58.98 13.65,59.68 11.37,59.68 Left.10
TFT_CS: length 38
  Top Layer w0.254: TFT.7 35.31,59.49 v1(35.31,56.95)
  Bottom Layer w0.254: Left.14 11.43,54.66 13.97,54.66 16.26,56.95 v1(35.31,56.95)
TFT_DC: length 38.2
  Top Layer w0.254: v1(34.42,55.68) 34.42,61.14 TFT.6
  Bottom Layer w0.254: Left.16 11.37,52.06 13.91,52.06 17.53,55.68 v1(34.42,55.68)
TFT_RST: length 38.4
  Top Layer w0.254: TFT.5 33.53,62.79 v1(33.53,54.41)
  Bottom Layer w0.254: Left.18 11.37,49.52 28.64,49.52 v1(33.53,54.41)
TFT_SCL: length 41
  Top Layer w0.254: TFT.3 31.5,54.53 33.4,52.63
  Bottom Layer w0.254: Left.22 11.37,44.44 25.46,44.44 v1(33.53,52.5)
TFT_SDA: length 31.3
  Top Layer w0.254: 34.04,65.84 32.51,64.31 v1(32.51,58.34)
  Bottom Layer w0.254: Left.12 11.37,57.14 13.91,57.14 15.11,58.34 v1(32.51,58.34)
$1N11794: length 6.7
  Bottom Layer w0.254: U5.3 43.93,12.62 ; U5.3 43.93,10.8 ; U5.3 45.69,10.92 R2.2 ; 43.93,12.62 43.93,12.88 ; 43.93,12.62 R1.1 41.98,12.65 CFF1.1
$1N12058: length 2.6
  Top Layer w0.762: LED1.2 26.43,4.83 R3.1

## Copper pours and planes (outline as drawn; the poured copper is in the pictures)
+5V on Bottom Layer: 50.41,67.11 53.59,67.11 53.59,64.2 50.41,64.2
+5V on Bottom Layer: 21.4,67.06 23.86,67.06 23.86,63.93 21.4,63.93
+5V on Bottom Layer: 35.7,26.01 43.11,26.01 43.11,23.91 35.7,23.91
+5V on Bottom Layer: 31.5,21.46 38.1,21.46 38.1,12.3 31.5,12.3
GND on Top Layer: 31.5,4.12 34.04,4.12 34.04,1.32 31.5,1.32
GND on Top Layer: 9.91,8.94 14.22,8.94 14.22,7 9.91,7
GND on Top Layer: -3.05,83.11 73.53,83.11 73.53,-2.36 -3.05,-2.36
GND on Top Layer: 56.39,9.5 62.36,9.5 62.36,6.93 56.39,6.93
GND on Bottom Layer: 31.5,4.12 34.04,4.12 34.04,1.32 31.5,1.32
GND on Bottom Layer: 19.26,67.08 22.22,67.08 22.22,62.23 19.26,62.23
GND on Bottom Layer: 48.14,67.05 51.18,67.05 51.18,62.45 48.14,62.45
GND on Bottom Layer: 57.64,9.07 62.36,9.07 62.36,6.8 57.64,6.8
GND on Bottom Layer: -1.91,82.22 73.53,82.22 73.53,-3.12 -1.91,-3.12
GND on Bottom Layer: 35.7,30.59 44.5,30.59 44.5,25.51 35.7,25.51
GND on Bottom Layer: 9.02,8.96 14.1,8.96 14.1,6.53 9.02,6.53
VCC on Bottom Layer: 35.7,28.68 43.11,28.68 43.11,26.87 35.7,26.87
VCC on Bottom Layer: 16.84,67.06 20.05,67.06 20.05,63.92 16.84,63.92
VCC on Bottom Layer: 46.48,67.05 49.11,67.05 49.11,64.11 46.48,64.11
VCC on Bottom Layer: 29.95,29.64 38.73,29.64 38.73,24.82 29.95,24.82
VIN on Bottom Layer: 34.29,9.65 43.69,9.65 43.69,1.19 34.29,1.19
MA1 on Bottom Layer: 50.42,65.2 54.33,65.2 54.33,63.68 50.42,63.68
MA2 on Bottom Layer: 50.42,63.42 54.23,63.42 54.23,61.9 50.42,61.9
MB1 on Bottom Layer: 21.46,64.31 24.71,64.31 24.71,63.37 21.46,63.37
MB2 on Bottom Layer: 21.46,63.17 24.71,63.17 24.71,62.28 21.46,62.28
$1N11791 on Bottom Layer: 38.91,11.48 42.42,11.48 42.42,10.08 38.91,10.08
$1N11801 on Bottom Layer: 31.5,11.38 42.42,11.38 42.42,7.93 31.5,7.93

## Text on the board
Top Silkscreen Layer: VCC | GND | 5V
